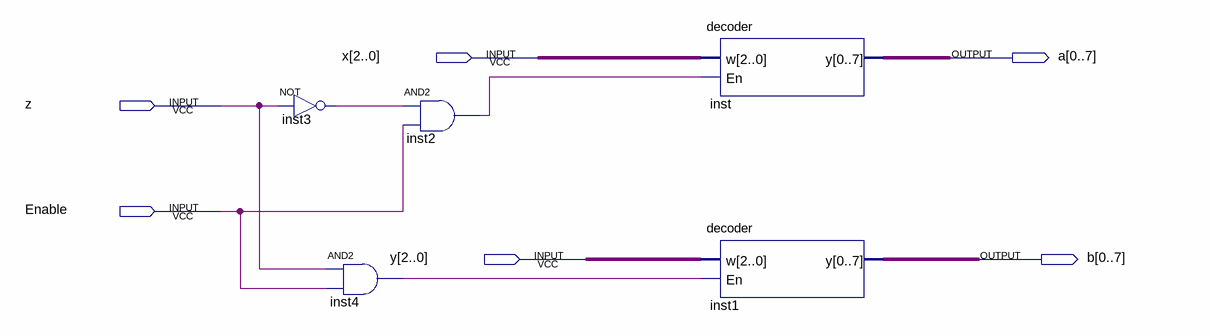
[diagram p0: schematic sheet]
// Quartus schematic FourtoSixteenDecoder.bdf as structural Verilog: 5 symbols, 6 pins
module FourtoSixteenDecoder (
  input  [2:0] x,
  input  z,
  input  Enable,
  input  [2:0] y,
  output [0:7] a,
  output [0:7] b
);

  wire inst2_out, inst3_out, inst4_out;

  not inst3 (inst3_out, z);
  and inst4 (inst4_out, z, Enable);
  and inst2 (inst2_out, inst3_out, Enable);
  decoder inst (.w(x), .En(inst2_out), .y(a));
  decoder inst1 (.w(y), .En(inst4_out), .y(b));
endmodule
